# EAGLE design Umbilical (EAGLE 9.5.0)
DESIGNER: Jayson Lopez; PART_NUMBER: 68-0009; PROJECT: CougSat Umbilical; REV: 1.0.4

## Sheet 1 of 4
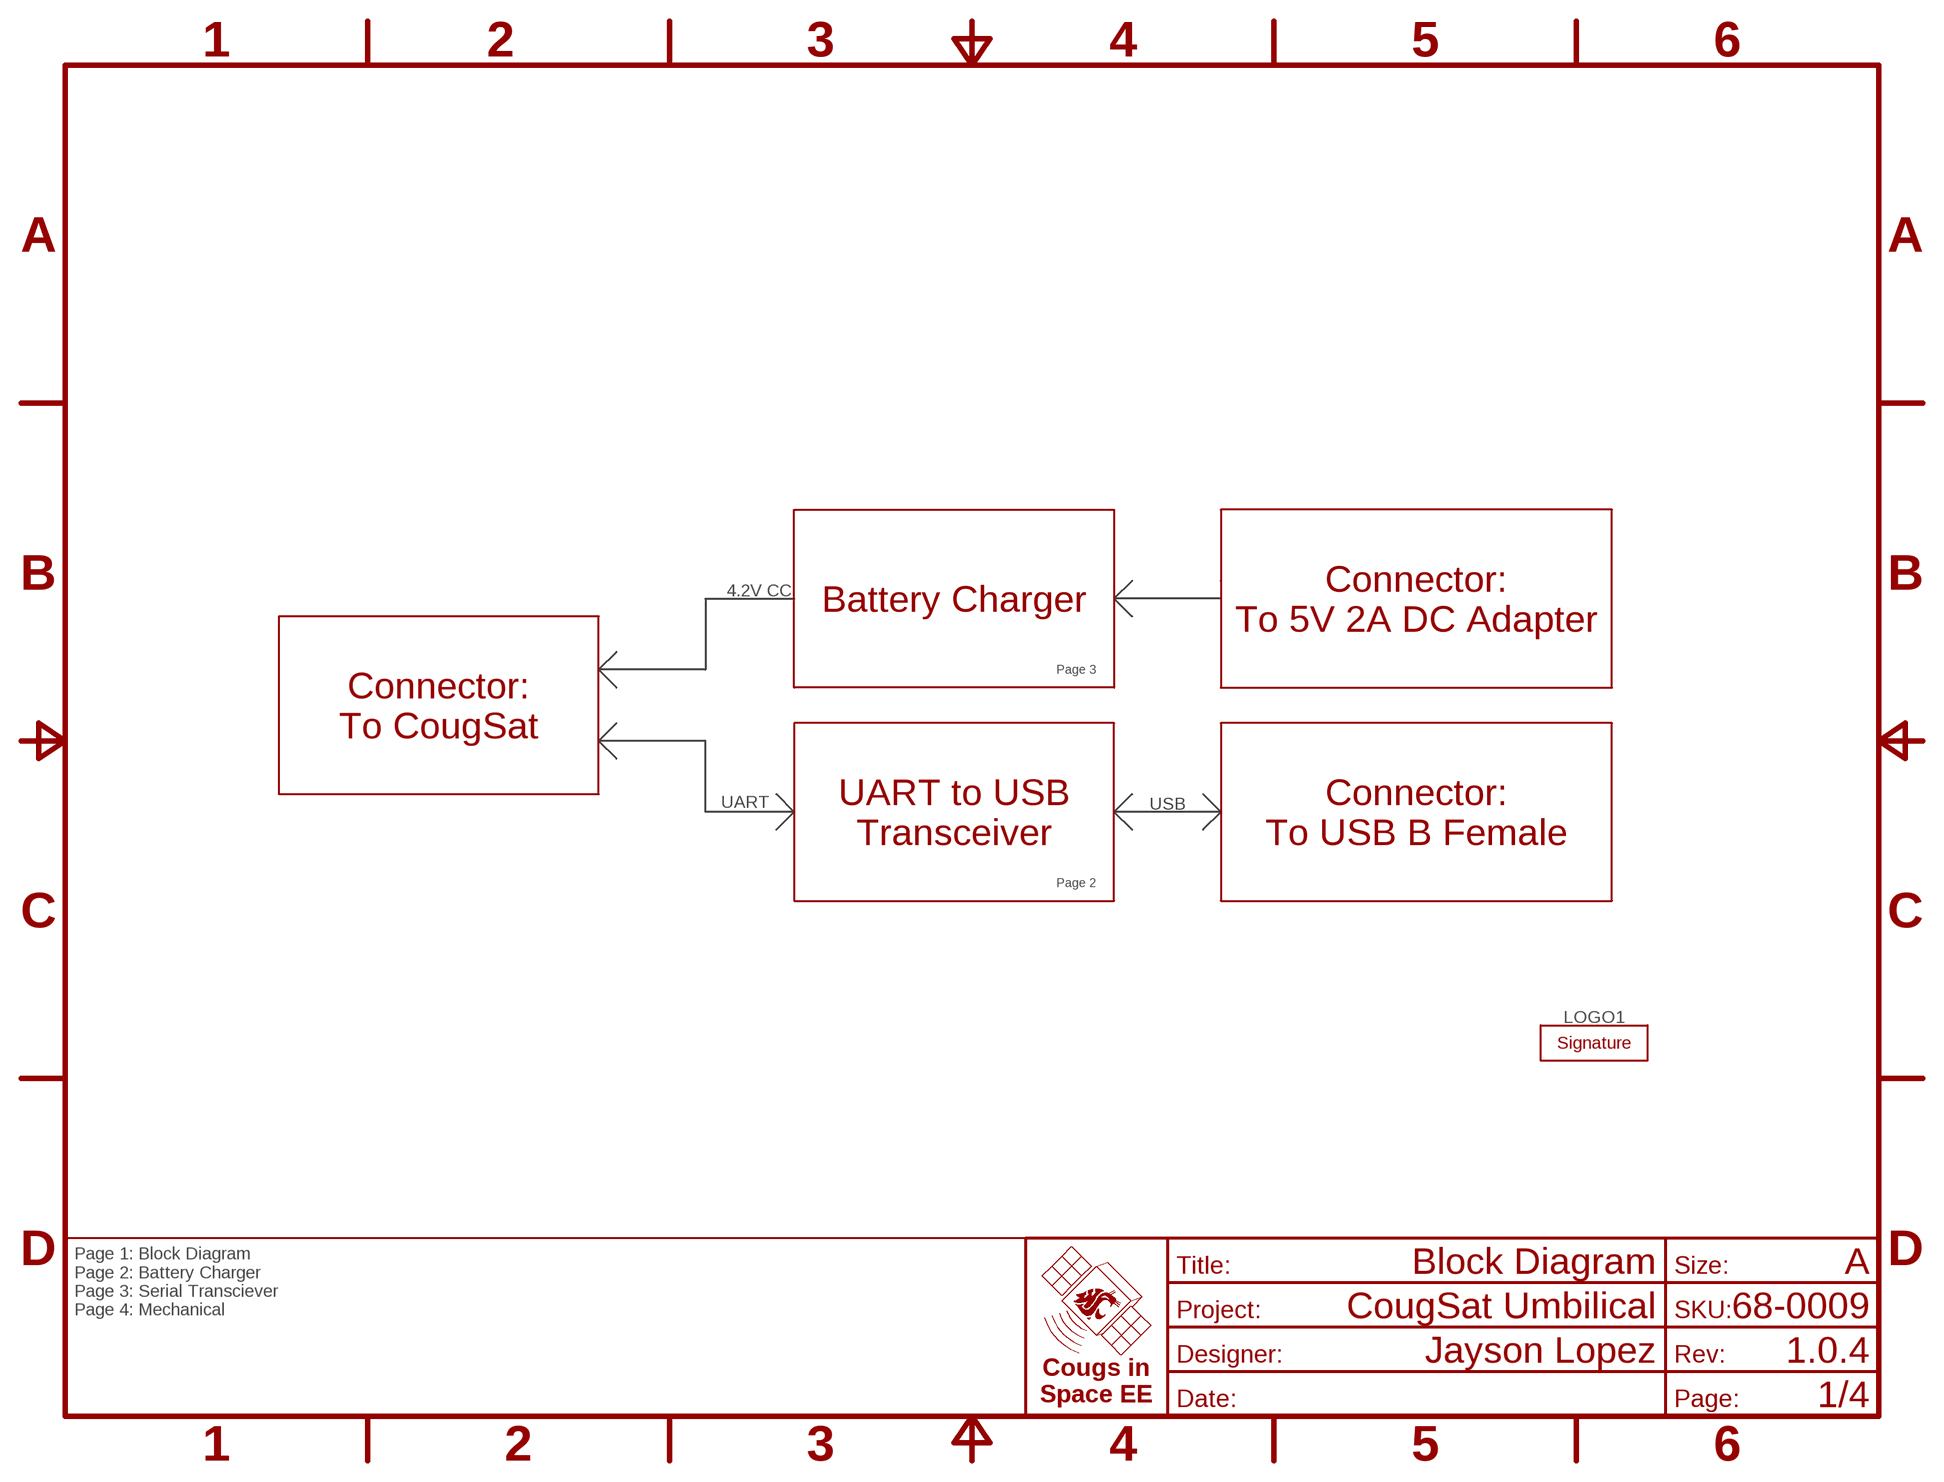
[diagram p0: schematic, sheet 1]
FRAME1 (FRAME-A): REV: 1.0.4; TITLE: Block Diagram

### Parts
LOGO1  SIGNATUREJAYSON  [SIGN-JAYSON]

### Notes on the sheet
- 4.2V CC
- Battery Charger
- Connector:
  To 5V 2A DC Adapter
- Page 3
- Connector:
  To CougSat
- UART | USB
- UART to USB
  Transceiver
- Connector:
  To USB B Female
- Page 2
- Page 1: Block Diagram
  Page 2: Battery Charger
  Page 3: Serial Transciever
  Page 4: Mechanical

## Sheet 2 of 4
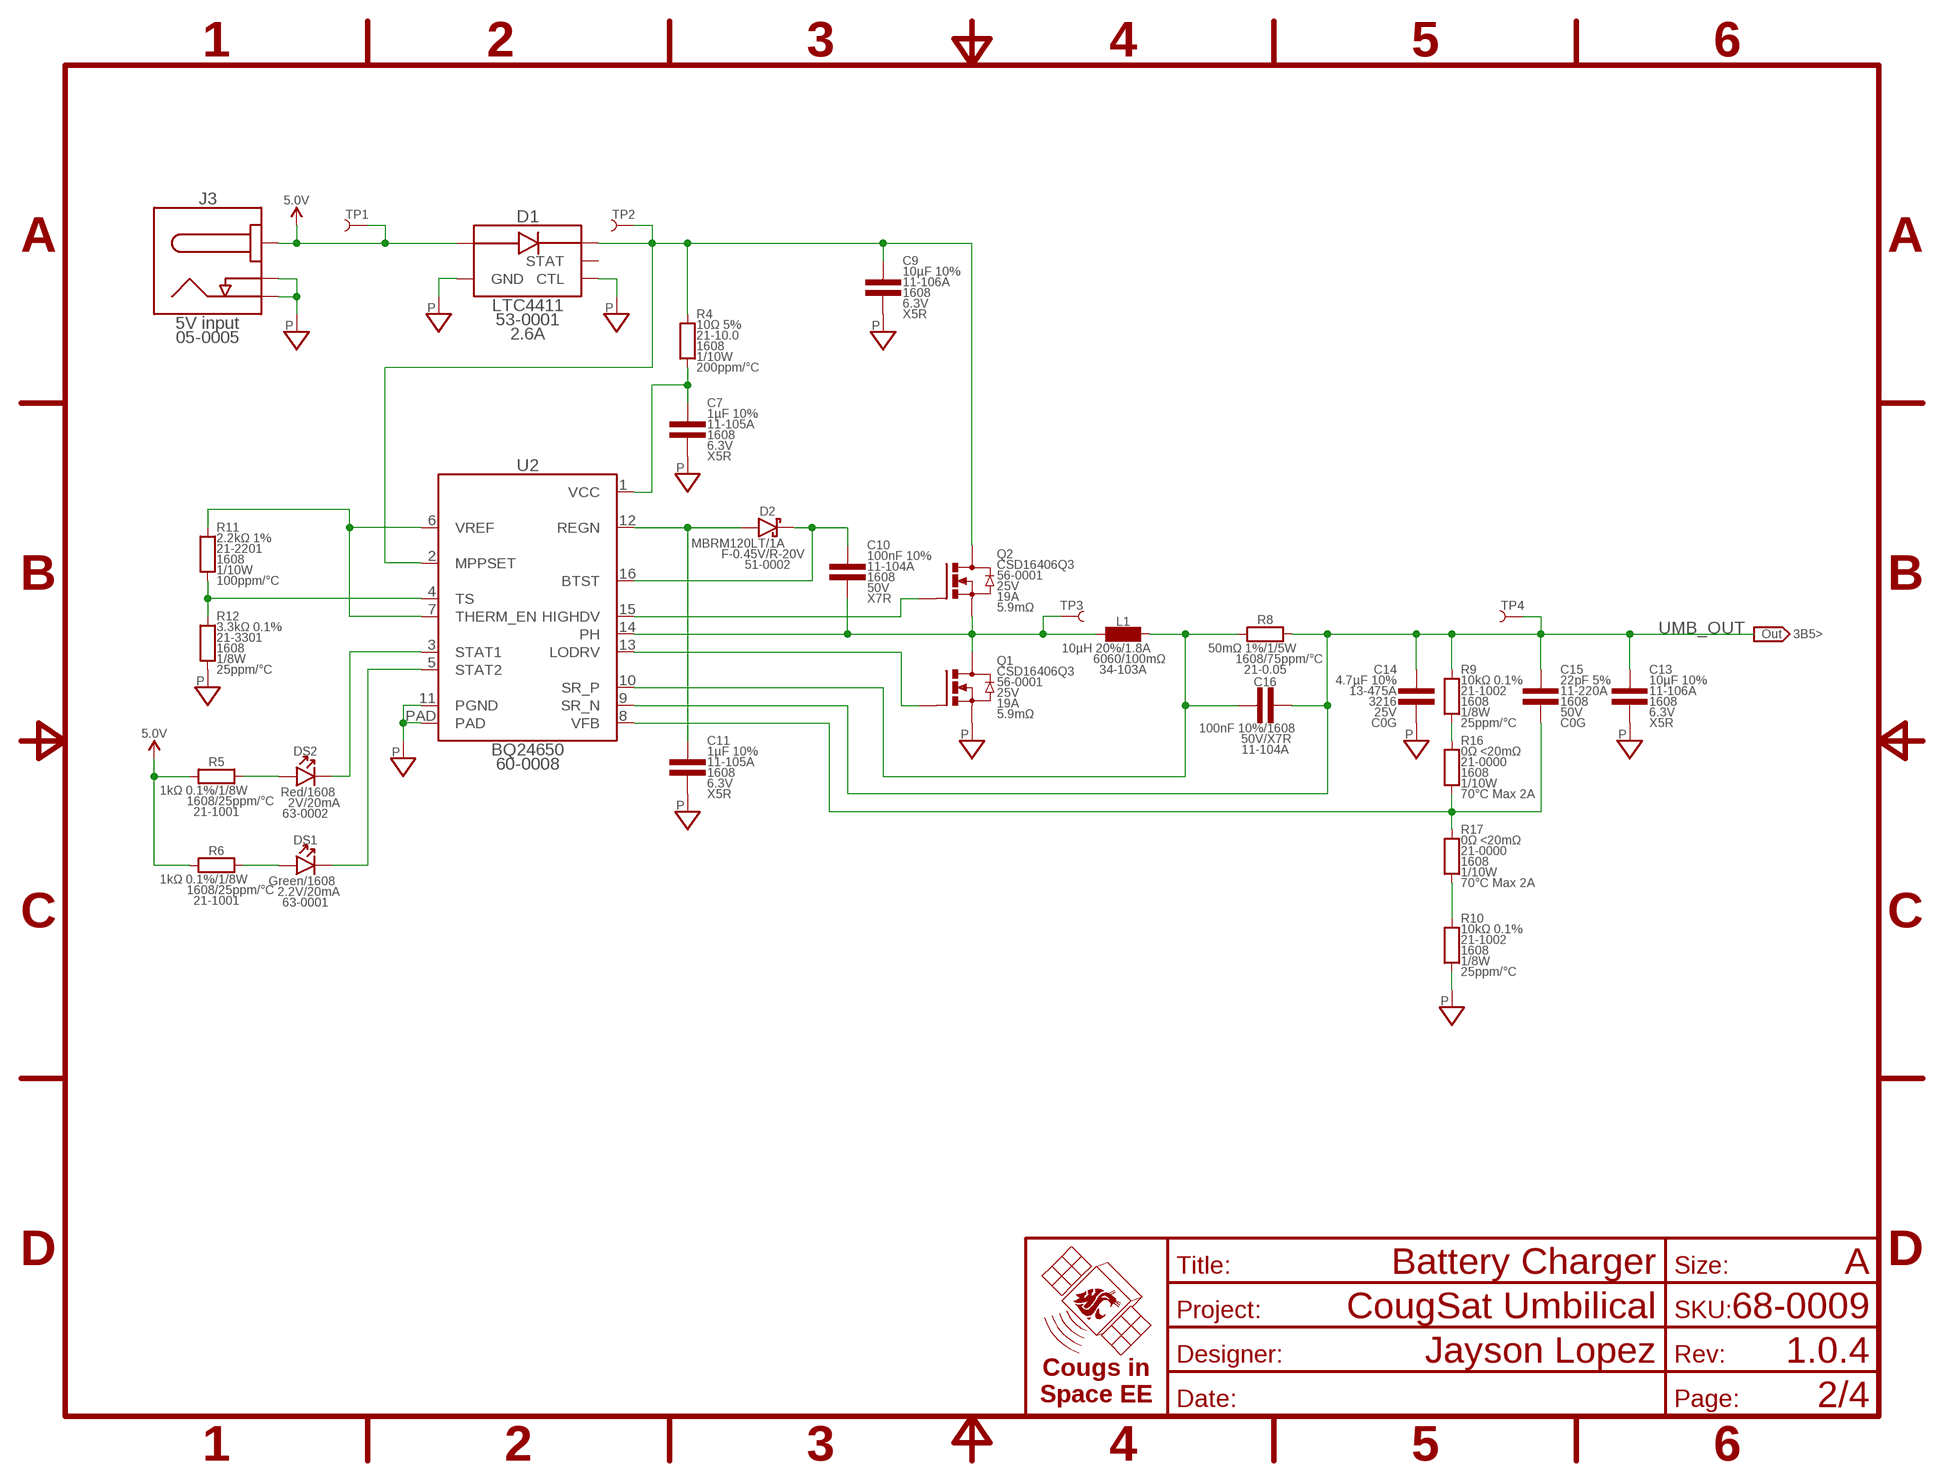
[diagram p1: schematic, sheet 2]
FRAME3 (FRAME-A): REV: 1.0.4; TITLE: Battery Charger

### Parts
C7  1µF 10%  CAP-V-1UF-1608  [1608]
C9  10µF 10%  CAP-V-10UF-1608  [1608]
C10  100nF 10%  CAP-V-100NF-1608  [1608]
C11  1µF 10%  CAP-V-1UF-1608  [1608]
C13  10µF 10%  CAP-V-10UF-1608  [1608]
C14  4.7µF 10%  CAP-V-4.7UF-3216  [3216]
C15  22pF 5%  CAP-V-22PF-1608  [1608]
C16  100nF 10%  CAP-H-100NF-1608  [1608]
D1  LTC4411  [SOT23-5]
D2  MBRM120LT  DIODE-SCHOTTKY-H-POWERMITE  [POWERMITE]
DS1  Green  LED-H-GRN-1608  [1608-POL]
DS2  Red  LED-H-RED-1608  [1608-POL]
J3  5V input  BARREL-2.1X5.5-R  [BARREL-2.1X5.5-R]
L1  10µH 20%  INDUCTOR-H-10UH-6060  [6060]
Q1  CSD16406Q3  MOSFET-N-SON-3333  [SON-3333]
Q2  CSD16406Q3  MOSFET-N-SON-3333  [SON-3333]
R4  10Ω 5%  RES-V-10R-1608  [1608]
R5  1kΩ 0.1%  RES-H-1K-1608  [1608]
R6  1kΩ 0.1%  RES-H-1K-1608  [1608]
R8  50mΩ 1%  RES-H-0.05R-1608  [1608]
R9  10kΩ 0.1%  RES-V-10K-1608  [1608]
R10  10kΩ 0.1%  RES-V-10K-1608  [1608]
R11  2.2kΩ 1%  RES-V-2.2K-1608  [1608]
R12  3.3kΩ 0.1%  RES-V-3.3K-1608  [1608]
R16  0Ω <20mΩ  RES-V-0-1608  [1608]
R17  0Ω <20mΩ  RES-V-0-1608  [1608]
TP1  TEST_POINT-THT-1.0  [THT-1.0]
TP2  TEST_POINT-THT-1.0  [THT-1.0]
TP3  TEST_POINT-THT-1.0  [THT-1.0]
TP4  TEST_POINT-THT-1.0  [THT-1.0]
U2  BQ24650  [QFN-16-3535]

### Nets
5.0V: D1.1(IN) J3.1(CENTER) R5.1 R6.1 TP1.1
BTST: C10.1 D2.C U2.16(BTST)
CHARGING_STAT_G: DS1.C U2.5(STAT2)
CHARGING_STAT_G_LED: DS1.A R6.2
CHARGING_STAT_R: DS2.C U2.3(STAT1)
CHARGING_STAT_R_LED: DS2.A R5.2
DIODE_OUT: C9.1 D1.5(OUT) Q2.5(D) Q2.6(D) Q2.7(D) Q2.8(D) Q2.PAD(D) R4.2 TP2.1 U2.2(MPPSET)
FEEDBACK_HIGH: R9.1 R16.2
FEEDBACK_LOW: R10.2 R17.1
HIGHDV: Q2.4(G) U2.15(HIGHDV)
LODRV: Q1.4(G) U2.13(LODRV)
PGND: C7.2 C9.2 C11.2 C13.2 C14.2 D1.2(GND) D1.3(CTL) J3.2(SLEEVE) J3.3(SW) Q1.1(S) Q1.2(S) Q1.3(S) R10.1 R12.1 U2.11(PGND) U2.PAD ; also sheet 3
PH: C10.2 L1.1 Q1.5(D) Q1.6(D) Q1.7(D) Q1.8(D) Q1.PAD(D) Q2.1(S) Q2.2(S) Q2.3(S) TP3.1 U2.14(PH)
REGN: C11.1 D2.A U2.12(REGN)
SR_P: C16.1 L1.2 R8.1 U2.10(SR_P)
TS: R11.1 R12.2 U2.4(TS)
UMB_OUT: C13.1 C14.1 C15.1 C16.2 R8.2 R9.2 TP4.1 U2.9(SR_N) ; also sheet 3
VCC: C7.1 R4.1 U2.1(VCC)
VFB: C15.2 R16.1 R17.2 U2.8(VFB)
VREF: R11.2 U2.6(VREF) U2.7(THERM_EN)
Unconnected: D1.4(STAT)

### Notes on the sheet
- 3B5>

## Sheet 3 of 4
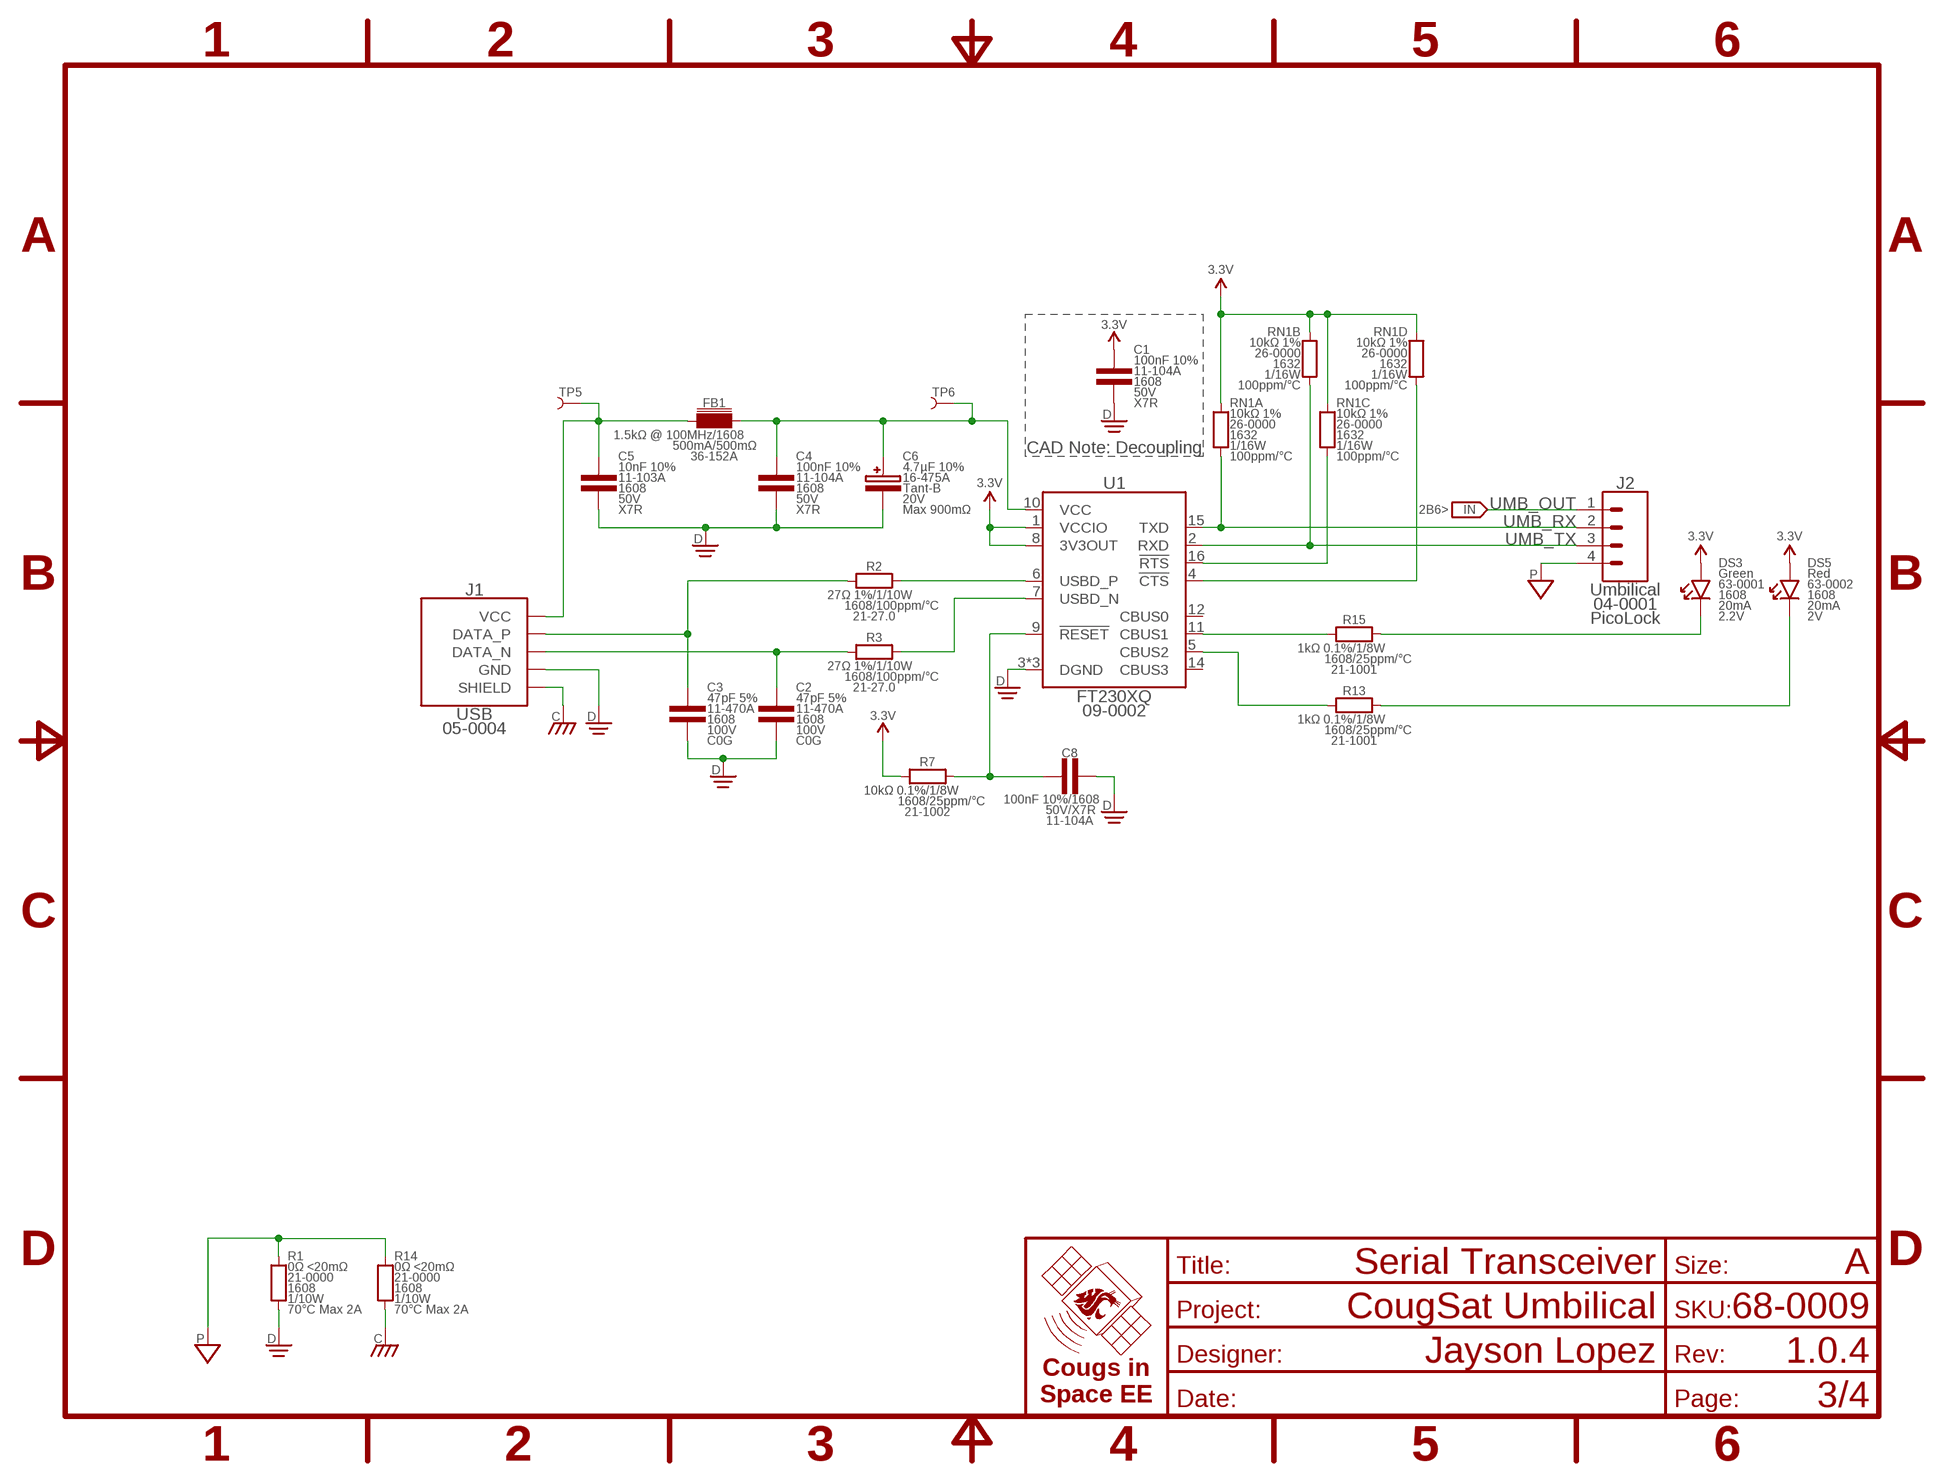
[diagram p2: schematic, sheet 3]
FRAME2 (FRAME-A): TITLE: Serial Transceiver

### Parts
C1  100nF 10%  CAP-V-100NF-1608  [1608]
C2  47pF 5%  CAP-V-47PF-1608  [1608]
C3  47pF 5%  CAP-V-47PF-1608  [1608]
C4  100nF 10%  CAP-V-100NF-1608  [1608]
C5  10nF 10%  CAP-V-10NF-1608  [1608]
C6  4.7µF 10%  CAP-POL-V-4.7UF-4028  [4028-POL]
C8  100nF 10%  CAP-H-100NF-1608  [1608]
DS3  Green  LED-V-GRN-1608  [1608-POL]
DS5  Red  LED-V-RED-1608  [1608-POL]
FB1  1.5kΩ @ 100MHz  CHOKE-H-1.5K-1608  [1608]
J1  USB  USB-B-FEMALE  [USB-B-FEMALE]
J2  Umbilical  1X04-PICOLOCK  [PICOLOCK1.5-04]
R1  0Ω <20mΩ  RES-V-0-1608  [1608]
R2  27Ω 1%  RES-H-27R-1608  [1608]
R3  27Ω 1%  RES-H-27R-1608  [1608]
R7  10kΩ 0.1%  RES-H-10K-1608  [1608]
R13  1kΩ 0.1%  RES-H-1K-1608  [1608]
R14  0Ω <20mΩ  RES-V-0-1608  [1608]
R15  1kΩ 0.1%  RES-H-1K-1608  [1608]
RN1  10kΩ 1%  RES-4-V-10K-1632  [1632]
TP5  TEST_POINT-THT-1.0  [THT-1.0]
TP6  TEST_POINT-THT-1.0  [THT-1.0]
U1  FT230XQ  FT230X-QFN16  [QFN-16-4040]

### Nets
3.3V: C1.1 DS3.A DS5.A R7.1 RN1.5 RN1.6 RN1.7 RN1.8 U1.1(VCCIO) U1.8(3V3OUT)
!CTS: RN1.4 U1.4(!CTS)
!RTS: RN1.3 U1.16(!RTS)
CBUS1: R15.1 U1.11(CBUS1)
CBUS2: R13.1 U1.5(CBUS2)
CHASSIS: J1.SHIELD@1(SHIELD) J1.SHIELD@2(SHIELD) R14.1
DGND: C1.2 C2.2 C3.2 C4.2 C5.2 C6.C C8.2 J1.4(GND) R1.1 U1.3(DGND) U1.13(DGND) U1.PAD(DGND)
PGND: J2.4 R1.2 R14.2 ; also sheet 2
RXLED_C: DS5.C R13.2
TXLED_C: DS3.C R15.2
UMB_OUT: J2.1 ; also sheet 2
UMB_RX: J2.2 RN1.1 U1.15(TXD)
UMB_TX: J2.3 RN1.2 U1.2(RXD)
USB5V: C5.1 FB1.1 J1.1(VCC) TP5.1
USB5V_FILTERED: C4.1 C6.A FB1.2 TP6.1 U1.10(VCC)
USB_CONN_N: C2.1 J1.2(DATA_N) R3.1
USB_CONN_P: C3.1 J1.3(DATA_P) R2.1
USB_N: R3.2 U1.7(USBD_N)
USB_P: R2.2 U1.6(USBD_P)
USB_RESET: C8.1 R7.2 U1.9(!RESET)
Unconnected: U1.12(CBUS0) U1.14(CBUS3)

### Notes on the sheet
- CAD Note: Decoupling
- 2B6>

## Sheet 4 of 4
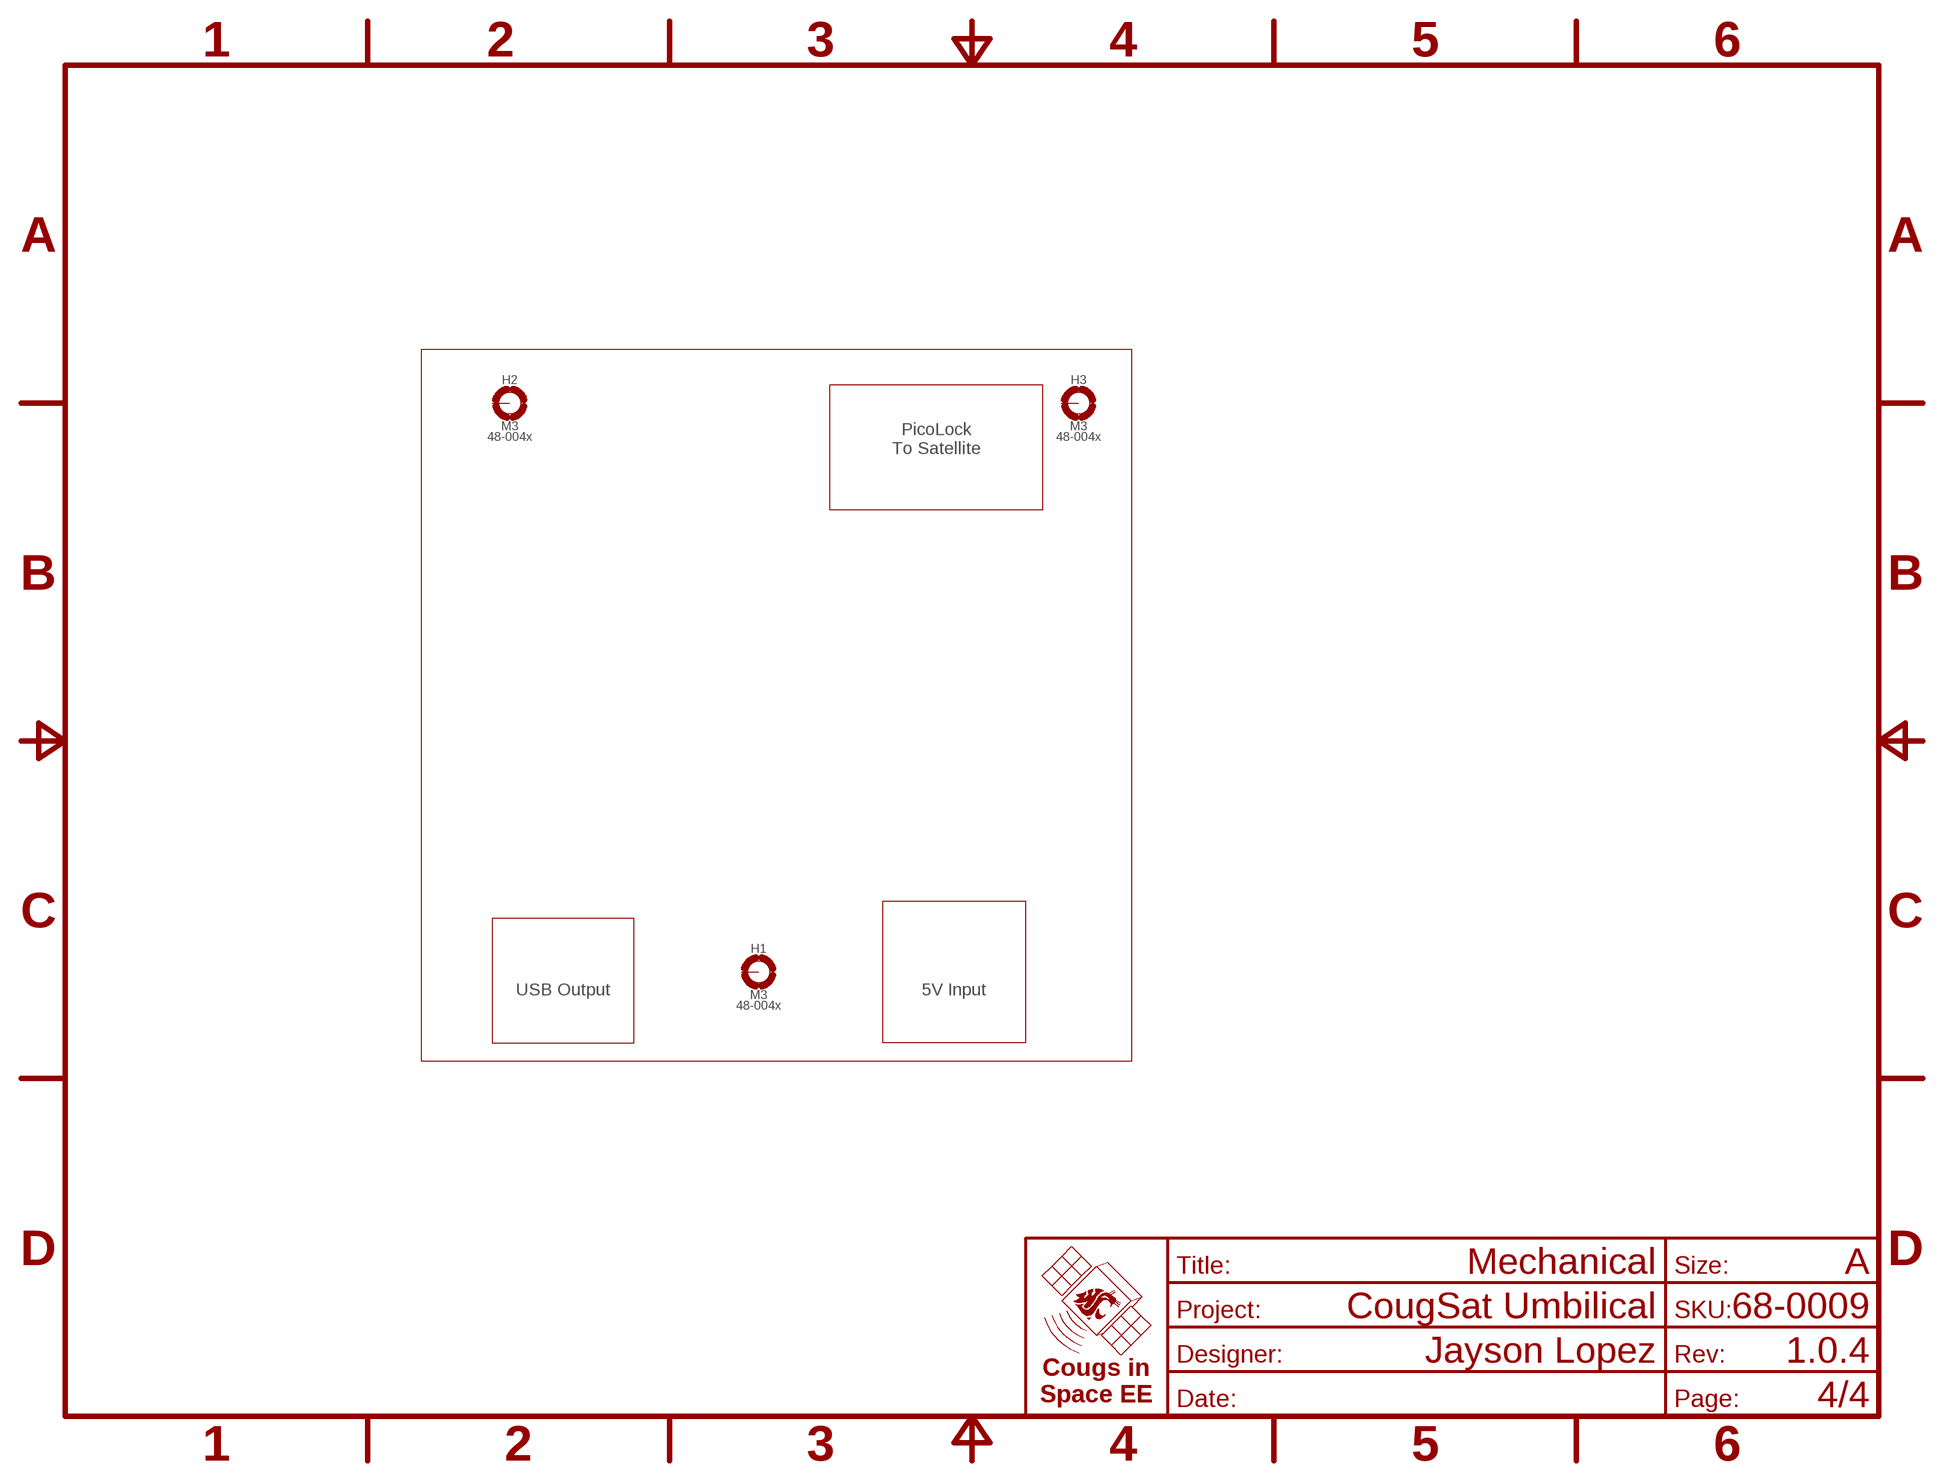
[diagram p3: schematic, sheet 4]
FRAME4 (FRAME-A): TITLE: Mechanical

### Parts
H1  M3  MOUNTING_HOLE-3.3  [MOUNTING_HOLE-3.3]
H2  M3  MOUNTING_HOLE-3.3  [MOUNTING_HOLE-3.3]
H3  M3  MOUNTING_HOLE-3.3  [MOUNTING_HOLE-3.3]
Unconnected: H1.1(MOUNT) H1.V1(MOUNT) H1.V2(MOUNT) H1.V3(MOUNT) H1.V4(MOUNT) H1.V5(MOUNT) H1.V6(MOUNT) H1.V7(MOUNT) H1.V8(MOUNT) H1.V9(MOUNT) H1.V10(MOUNT) H2.1(MOUNT) H2.V1(MOUNT) H2.V2(MOUNT) H2.V3(MOUNT) H2.V4(MOUNT) H2.V5(MOUNT) H2.V6(MOUNT) H2.V7(MOUNT) H2.V8(MOUNT) H2.V9(MOUNT) H2.V10(MOUNT) H3.1(MOUNT) H3.V1(MOUNT) H3.V2(MOUNT) H3.V3(MOUNT) H3.V4(MOUNT) H3.V5(MOUNT) H3.V6(MOUNT) H3.V7(MOUNT) H3.V8(MOUNT) H3.V9(MOUNT) H3.V10(MOUNT)

### Notes on the sheet
- PicoLock
  To Satellite
- USB Output | 5V Input

## Library data of the parts
C1 C4 C10 = CougsInSpace-Capacitors:CAP-V: Capacitor - Vertical Orientation; PACKAGE: 1608; SKU: 11-104A; TEMP: X7R; VOLTAGE: 50V
C2 C3 = CougsInSpace-Capacitors:CAP-V: Capacitor - Vertical Orientation; PACKAGE: 1608; SKU: 11-470A; TEMP: C0G; VOLTAGE: 100V
C5 = CougsInSpace-Capacitors:CAP-V: Capacitor - Vertical Orientation; PACKAGE: 1608; SKU: 11-103A; TEMP: X7R; VOLTAGE: 50V
C6 = CougsInSpace-Capacitors:CAP-POL-V: Capacitor Polarized - Vertical Orientation; ESR: Max 900mΩ; PACKAGE: Tant-B; SKU: 16-475A; VOLTAGE: 20V
C7 C11 = CougsInSpace-Capacitors:CAP-V: Capacitor - Vertical Orientation; PACKAGE: 1608; SKU: 11-105A; TEMP: X5R; VOLTAGE: 6.3V
C8 C16 = CougsInSpace-Capacitors:CAP-H: Capacitor - Horizontal Orientation; PACKAGE: 1608; SKU: 11-104A; TEMP: X7R; VOLTAGE: 50V
C9 C13 = CougsInSpace-Capacitors:CAP-V: Capacitor - Vertical Orientation; PACKAGE: 1608; SKU: 11-106A; TEMP: X5R; VOLTAGE: 6.3V
C14 = CougsInSpace-Capacitors:CAP-V: Capacitor - Vertical Orientation; PACKAGE: 3216; SKU: 13-475A; TEMP: C0G; VOLTAGE: 25V
C15 = CougsInSpace-Capacitors:CAP-V: Capacitor - Vertical Orientation; PACKAGE: 1608; SKU: 11-220A; TEMP: C0G; VOLTAGE: 50V
D1 = CougsInSpace-DiscreteSemi:LTC4411: LTC4411 Ideal diode (transistor acting as a diode); CURRENT: 2.6A; SKU: 53-0001
D2 = CougsInSpace-DiscreteSemi:DIODE-SCHOTTKY-H: Diode Schottky Horizontal; CURRENT: 1A; SKU: 51-0002; VF: F-0.45V; VR: R-20V
DS1 = CougsInSpace-LEDs:LED-H: LED Horizontal; CURRENT: 20mA; PACKAGE: 1608; SKU: 63-0001; VF: 2.2V
DS2 = CougsInSpace-LEDs:LED-H: LED Horizontal; CURRENT: 20mA; PACKAGE: 1608; SKU: 63-0002; VF: 2V
DS3 = CougsInSpace-LEDs:LED-V: LED Vertical; CURRENT: 20mA; PACKAGE: 1608; SKU: 63-0001; VF: 2.2V
DS5 = CougsInSpace-LEDs:LED-V: LED Vertical; CURRENT: 20mA; PACKAGE: 1608; SKU: 63-0002; VF: 2V
FB1 = CougsInSpace-Coils:CHOKE-H: Choke (Ferrite Bead) Horizontal; CURRENT: 500mA; DCR: 500mΩ; PACKAGE: 1608; SKU: 36-152A
H1-H3 = CougsInSpace-Hardware:MOUNTING_HOLE: Mounting Hole; SKU: 48-004x
J1 = CougsInSpace-Connectors:USB: USB 1.0/2.0; SKU: 05-0004
J2 = CougsInSpace-Connectors:1X04: Generic Connector - 4 Conductor; PACKAGE: PicoLock; SKU: 04-0001
J3 = CougsInSpace-Connectors:BARREL: Barrel Connector Normal closed switch; SKU: 05-0005
L1 = CougsInSpace-Coils:INDUCTOR-H: Inductor Horizontal; CURRENT: 1.8A; DCR: 100mΩ; PACKAGE: 6060; SKU: 34-103A
LOGO1 = CougsInSpace-Aesthetics:SIGNATURE: Designer's (Artist's) Signature
Q1 Q2 = CougsInSpace-DiscreteSemi:MOSFET-N: N-Channel MOSFET; CURRENT: 19A; RDS: 5.9mΩ; SKU: 56-0001; VDS: 25V
R1 R14 R16 R17 = CougsInSpace-Resistors:RES-V: Resistor Vertical; PACKAGE: 1608; POWER: 1/10W; SKU: 21-0000; TEMP: 70°C Max 2A
R2 R3 = CougsInSpace-Resistors:RES-H: Resistor Horizontal; PACKAGE: 1608; POWER: 1/10W; SKU: 21-27.0; TEMP: 100ppm/°C
R4 = CougsInSpace-Resistors:RES-V: Resistor Vertical; PACKAGE: 1608; POWER: 1/10W; SKU: 21-10.0; TEMP: 200ppm/°C
R5 R6 R13 R15 = CougsInSpace-Resistors:RES-H: Resistor Horizontal; PACKAGE: 1608; POWER: 1/8W; SKU: 21-1001; TEMP: 25ppm/°C
R7 = CougsInSpace-Resistors:RES-H: Resistor Horizontal; PACKAGE: 1608; POWER: 1/8W; SKU: 21-1002; TEMP: 25ppm/°C
R8 = CougsInSpace-Resistors:RES-H: Resistor Horizontal; PACKAGE: 1608; POWER: 1/5W; SKU: 21-0.05; TEMP: 75ppm/°C
R9 R10 = CougsInSpace-Resistors:RES-V: Resistor Vertical; PACKAGE: 1608; POWER: 1/8W; SKU: 21-1002; TEMP: 25ppm/°C
R11 = CougsInSpace-Resistors:RES-V: Resistor Vertical; PACKAGE: 1608; POWER: 1/10W; SKU: 21-2201; TEMP: 100ppm/°C
R12 = CougsInSpace-Resistors:RES-V: Resistor Vertical; PACKAGE: 1608; POWER: 1/8W; SKU: 21-3301; TEMP: 25ppm/°C
RN1 = CougsInSpace-Resistors:RES-4-V: Resistor Array - 4 - Vertical; PACKAGE: 1632; POWER: 1/16W; SKU: 26-0000; TEMP: 100ppm/°C
TP1-TP6 = CougsInSpace-Connectors:TEST_POINT: Test Point Used to probe points in a circuit for debugging or general measurement
U1 = CougsInSpace-IC-Comms:FT230X: FT230x USB/UART Bridge FT230x <https://github.com/CougsInSpace/Resources/blob/master/SupplierDocuments/FTDI/FT230X_USB-UARTBridge.pdf>; SKU: 09-0002
U2 = CougsInSpace-IC-Power:BQ24650: BQ24650 Solar Battery Charger BQ24650 <https://github.com/CougsInSpace/Resources/blob/master/SupplierDocuments/Ti/SolarBatteryCharger_BQ24650.pdf>; SKU: 60-0008

## Board
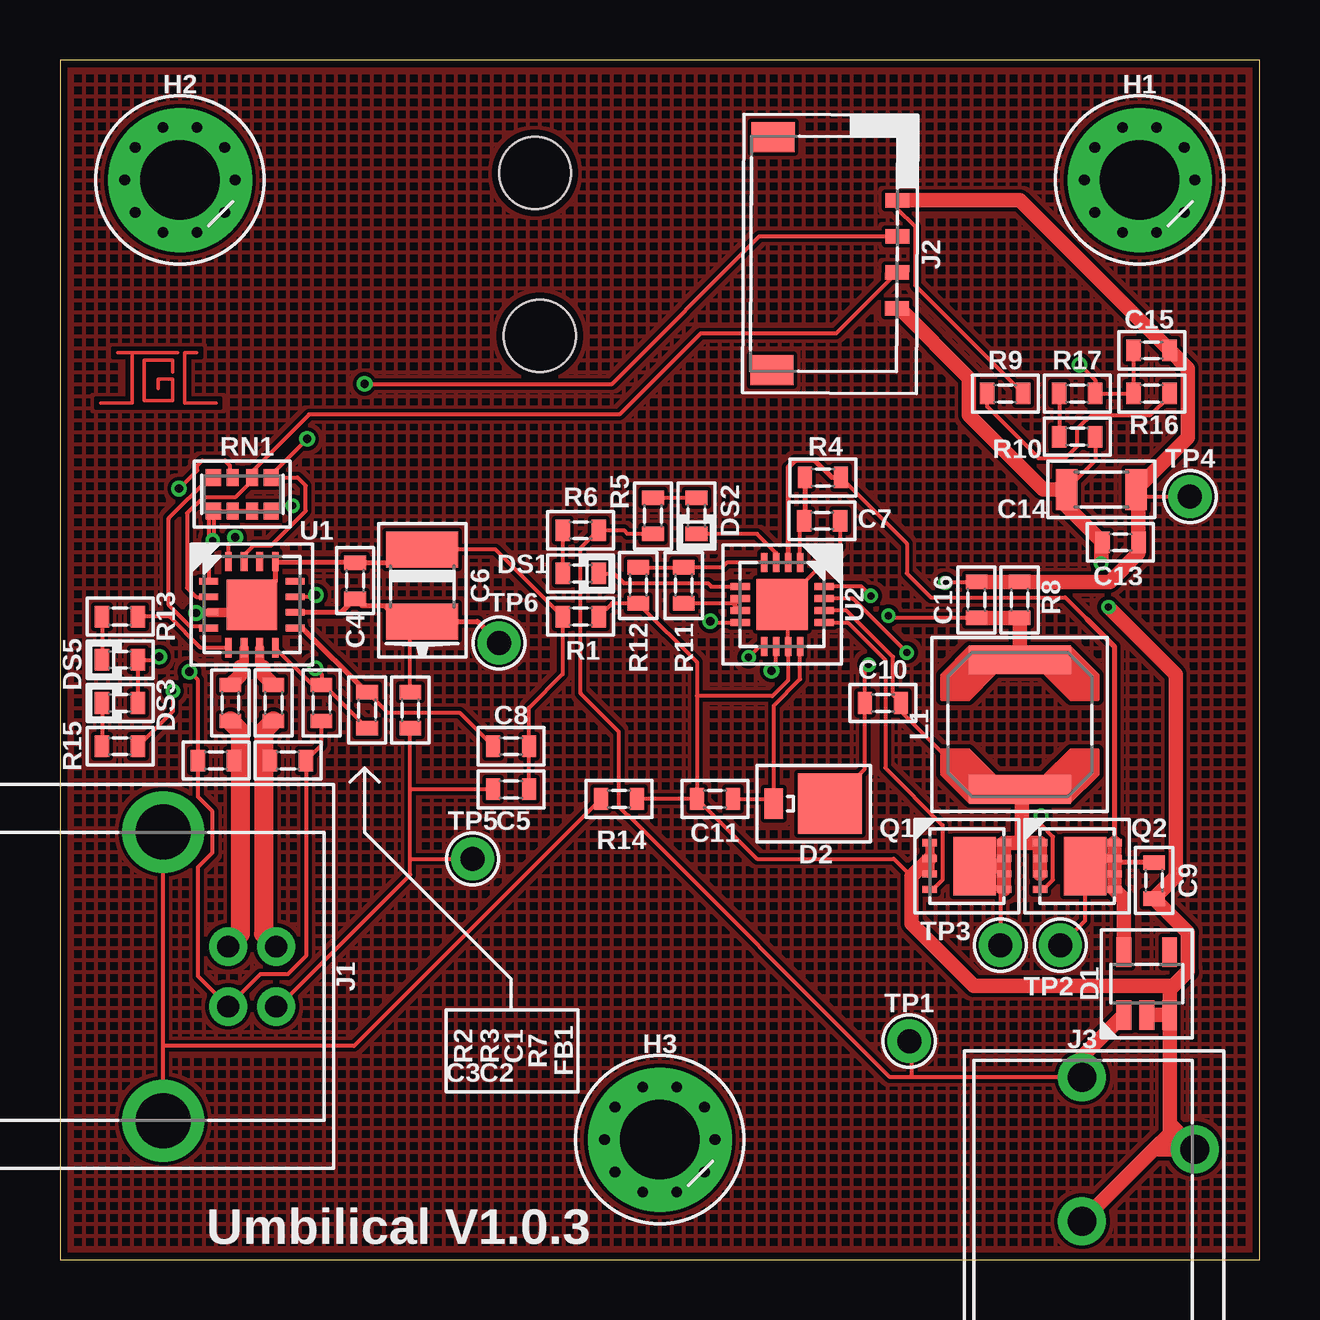
[diagram p4: board, top side]
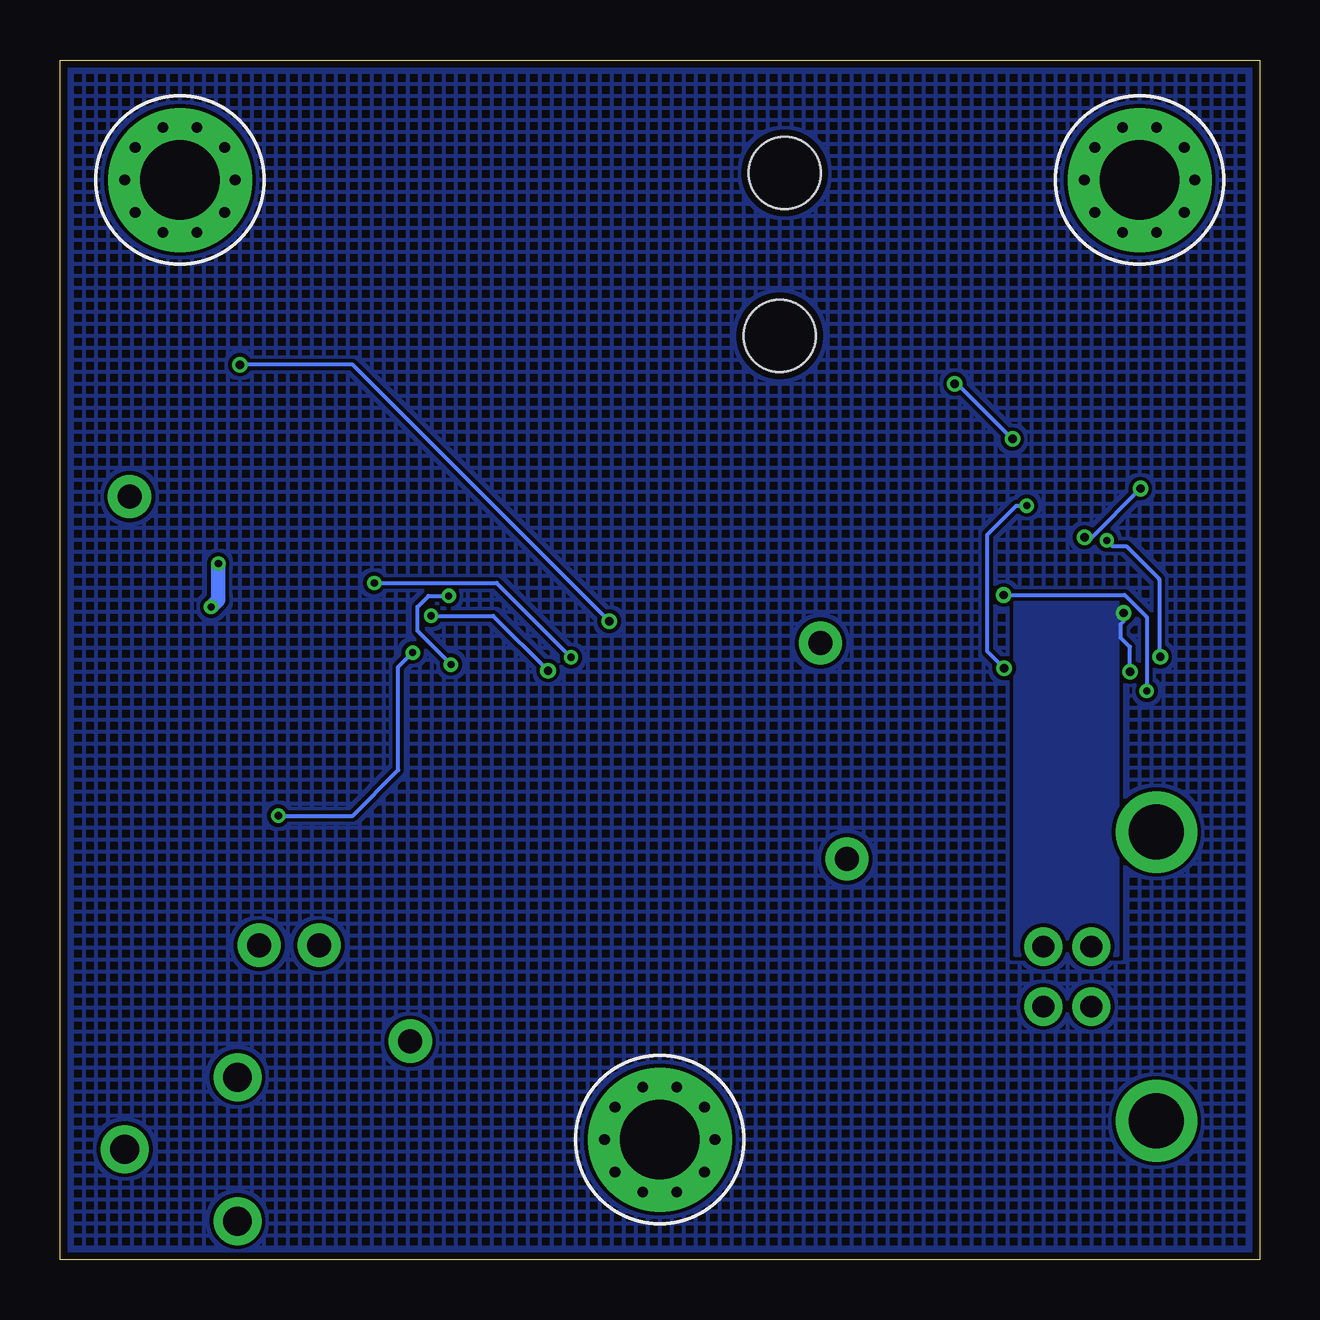
[diagram p5: board, bottom side, seen from below]

Size 50 x 50 mm. Coordinates in mm from the lower left corner, seen from the top.
Outline: 0,0 50,0 50,50 0,50 0,0
Copper layers (1*16): Top 0.035mm / dielectric 1.6mm / Bottom 0.035mm
Design rules "CougsInSpace": minimum track width 0.16mm, minimum drill 0.3mm, track to track 0.16mm, track to pad 0.16mm, pad to pad 0.16mm, via to via 0.16mm, smd to smd 0mil, copper to edge 0.3mm, drill to drill 0.3mm, minimum pad ring 0.15mm, minimum via ring 0.15mm, stop-mask expansion 0mil, vias tented up to drill 1mm, thermal gap 0.25mm
Holes 3 mm at 19.8,45.3 20,38.5

### Footprints (pad centres in the part's own frame; a part is rotated, then mirrored left to right if it is on the bottom)
1608 = smd 0.6 x 0.9: 1 -0.75,0; 2 0.75,0
4028-POL = smd 1.5 x 3: A 1.5,0; C -1.5,0
3216 = smd 0.9 x 1.7: 1 -1.45,0; 2 1.45,0
SOT23-5 = smd 1.22 x 0.62: 1 -1.31,0.95; 2 -1.31,0; 3 -1.31,-0.95; 4 1.31,-0.95; 5 1.31,0.95
POWERMITE = smd 0.76 x 1.27: A 2.349,0 | smd 2.67 x 2.54: C 0,0
1608-POL = smd 0.6 x 0.9: A 0.75,0; C -0.75,0
MOUNTING_HOLE-3.3 = drill 3.3 pad 6: 1 0,0 | drill 0.45 pad 0.6: V1 2.3,0; V2 1.861,1.352; V3 0.711,2.187; V4 -0.711,2.187; V5 -1.861,1.352; V6 -2.3,0; V7 -1.861,-1.352; V8 -0.711,-2.187; V9 0.711,-2.187; V10 1.861,-1.352
USB-B-FEMALE = drill 0.9 pad 1.6: 1 1.25,4.71; 2 -1.25,4.71; 3 -1.25,2.71; 4 1.25,2.71 | drill 2.3 pad 3.4: SHIELD@1 -6.02,0; SHIELD@2 6.02,0
PICOLOCK1.5-04 = smd 0.6 x 1: 1 2.25,0; 2 0.75,0; 3 -0.75,0; 4 -2.25,0 | smd 1.25 x 1.8: PAD@1 4.855,5.2; PAD@2 -4.855,5.2
BARREL-2.1X5.5-R = drill 1.2 pad 2: 1 0,-3; 2 0,3; 3 -4.7,0
6060 = smd 1.2 x 4.25: 1 -2.7,0; 2 2.7,0
SON-3333 = smd 0.6 x 0.3: 1 -1.55,0.975; 2 -1.55,0.325; 3 -1.55,-0.325; 4 -1.55,-0.975; 5 1.55,-0.975; 6 1.55,-0.325; 7 1.55,0.325; 8 1.55,0.975 | smd 1.775 x 2.45: PAD 0.325,0
1632 = smd 0.64 x 0.7: 1 -1.2,-0.7; 4 1.2,-0.7; 5 1.2,0.7; 8 -1.2,0.7 | smd 0.5 x 0.7: 2 -0.4,-0.7; 3 0.4,-0.7; 6 0.4,0.7; 7 -0.4,0.7
THT-1.0 = drill 1 pad 1.8: 1 0,0
QFN-16-4040 = smd 0.8 x 0.28: 1 -1.8,0.975; 2 -1.8,0.325; 3 -1.8,-0.325; 4 -1.8,-0.975; 9 1.8,-0.975; 10 1.8,-0.325; 11 1.8,0.325; 12 1.8,0.975 | smd 0.28 x 0.8: 5 -0.975,-1.8; 6 -0.325,-1.8; 7 0.325,-1.8; 8 0.975,-1.8; 13 0.975,1.8; 14 0.325,1.8; 15 -0.325,1.8; 16 -0.975,1.8 | smd 2.1 x 2.1: PAD 0,0
QFN-16-3535 = smd 0.8 x 0.28: 1 -1.75,0.75; 2 -1.75,0.25; 3 -1.75,-0.25; 4 -1.75,-0.75; 9 1.75,-0.75; 10 1.75,-0.25; 11 1.75,0.25; 12 1.75,0.75 | smd 0.28 x 0.8: 5 -0.75,-1.75; 6 -0.25,-1.75; 7 0.25,-1.75; 8 0.75,-1.75; 13 0.75,1.75; 14 0.25,1.75; 15 -0.25,1.75; 16 -0.75,1.75 | smd 2.14 x 2.14: PAD 0,0

### Placement (x,y rotation side)
C1  10.9,23.2 270 top
C2  9.5,20.8 0 top
C3  6.5,20.8 180 top
C4  12.3,28.3 90 top
C5  18.8,19.6 0 top
C6  15.1,28.1 270 top
C7  31.77,30.79 0 top
C8  18.8,21.4 0 top
C9  45.6,15.8 270 top
C10  34.3,23.2 0 top
C11  27.3,19.2 180 top
C13  44.2,29.9 180 top
C14  43.4,32.1 180 top
C15  45.5,37.9 180 top
C16  38.2,27.5 90 top
D1  45.3,11.5 90 top
D2  32.1,19 180 top
DS1  21.7,28.6 180 top
DS2  26.53,31 90 top
DS3  2.5,23.2 0 top
DS5  2.5,25 0 top
FB1  14.6,22.9 90 top
H1  45,45 0 top
H2  5,45 0 top
H3  25,5 0 top
J1  4.3,11.8 270 top
J2  34.9,41.9 89.7 top
J3  42.6,4.6 180 top
L1  40,22.3 90 top
LOGO1  4.1,36.7 0 top
Q1  37.8,16.4 0 top
Q2  42.4,16.4 0 top
R1  21.7,26.8 0 top
R2  7.1,23.2 90 top
R3  8.9,23.2 90 top
R4  31.8,32.6 0 top
R5  24.72,31 90 top
R6  21.7,30.4 180 top
R7  12.8,22.9 90 top
R8  40,27.5 90 top
R9  39.4,36.1 0 top
R10  42.4,34.3 180 top
R11  26,28.1 270 top
R12  24.1,28.1 90 top
R13  2.5,26.8 180 top
R14  23.3,19.2 0 top
R15  2.5,21.4 180 top
R16  45.5,36.1 0 top
R17  42.4,36.1 0 top
RN1  7.6,31.9 180 top
TP1  35.4,9.1 0 top
TP2  41.7,13.1 0 top
TP3  39.2,13.1 0 top
TP4  47.1,31.8 0 top
TP5  17.2,16.7 0 top
TP6  18.3,25.7 0 top
U1  8,27.3 0 top
U2  30.1,27.3 270 top

### Tracks (layer width: path | path; a pad name or v marks a point on that pad's centre or on a via)
3.3V  (via drill 0.3, 0.35)
  Top 0.16: U1.8 10.53,23.95 C1.1 10.9,24.4 v10.65,24.65 | RN1.5 6.2,31 U1.1 | R7.1 11,23.95 | RN1.5 RN1.6 RN1.7 RN1.8 9.03,31.43 v9.7,31.43 | DS3.A DS5.A 4.01,25 v4.13,25.12 | v6.37,29.97 6.4,30.01 RN1.5
  Top 0.4: 11,23.95 C1.1
  Bottom 0.16: v10.65,24.65 11.35,25.35 11.35,30.22 10.14,31.43 v9.7,31.43 | v6.37,29.97 6.13,29.73 5.56,29.73 4.18,28.36 4.18,25.16 v4.13,25.12
5.0V
  Top 0.16: R5.1 23.65,30.25 23.5,30.4 R6.1 21.7,29.65 21.7,23.6 23.3,22 23.3,18.86 23.65,18.51 23.69,18.51 34.6,7.6 35.4,7.6 | TP1.1 35.5,9 35.5,7.7 35.4,7.6 | J3.1 35.4,7.6
  Top 0.6: J3.1 42.6,8.44 D1.1
!CTS
  Top 0.16: U1.4 6.14,26.39 5.43,26.39 4.54,27.29 4.54,30.91 6.23,32.6 RN1.4
!RTS  (via drill 0.35)
  Top 0.16: v4.97,32.13 5.72,32.89 5.72,33.1 5.93,33.31 6.87,33.31 7.08,33.1 7.08,32.72 RN1.3 | U1.16 7.03,29.82 v7.3,30.1
  Bottom 0.16: v7.3,30.1 7,30.1 v4.97,32.13
BALANCING-BOTTOM
  pour Bottom (rank 6, hatched): 0,0 0,50 50,50 50,0
BALANCING-TOP
  pour Top (rank 6, hatched): 0,0.1 0,50 50,50 50,0.1
BTST  (via drill 0.3)
  Top 0.16: v33.8,27.66 33.41,28.05 U2.16 | D2.C 33.55,20.45 C10.1 33.55,24.65 v33.7,24.8
  Bottom 0.16: v33.7,24.8 35.1,26.2 35.1,27.2 34.64,27.66 v33.8,27.66
CBUS1  (via drill 0.3, 0.35)
  Top 0.16: v10.66,27.7 10.59,27.62 U1.11 | v4.7,23.7 4.7,22.85 R15.1
  Bottom 0.16: v10.66,27.7 5.62,27.7 4.7,26.78 v4.7,23.7
CBUS2
  Top 0.16: U1.5 5.87,25.5 4.57,26.8 R13.1
CHARGING_STAT_G
  Top 0.16: DS1.C 23.09,28.6 23.5,28.19 27.01,28.19 27.15,28.05 U2.5
CHARGING_STAT_G_LED
  Top 0.16: R6.2 DS1.A
CHARGING_STAT_R
  Top 0.16: U2.3 29.85,29.46 29.06,30.25 DS2.C
CHARGING_STAT_R_LED
  Top 0.16: DS2.A R5.2
CHASSIS
  Top 0.16: J1.SHIELD@2 4.3,8.9 | 4.3,8.9 J1.SHIELD@1 | R14.1 12.25,8.9 4.3,8.9
DGND  (via drill 0.35)
  Top 0.16: C1.2 10.9,21.45 C2.2 10.25,12.65 9.49,11.89 8.35,11.89 J1.4 5.75,11.81 5.75,16.36 6.36,16.97 6.36,18.67 5.75,19.28 C3.2 5.75,24.15 v5.4,24.5 | v5.67,26.95 5.69,26.98 6.6,26.98 | C6.C 18.15,29.6 R1.1 20.95,24.4 19.55,23 C8.2 C5.2
  Top 0.2: C6.C 14.55,29.05 C4.2 9.03,29.05 U1.13 8.97,28.27 U1.PAD 7.67,26.98 6.6,26.98 U1.3
  Top 0.4: U1.3 7.67,26.98
  Bottom 0.16: v5.4,24.5 5.4,25.53 5.79,25.92 5.79,26.48 5.67,26.6 v5.67,26.95
  pour Bottom: 5.9,12.7 5.9,27.4 10.2,27.4 10.2,12.7
DIODE_OUT
  Top 0.16: R4.2 35.3,29.85 35.3,28.6 36.3,27.6 41.9,27.6 42.8,26.7 | Q2.PAD 42.73,14.12 TP2.1
  Top 0.2: R4.2 32.17,32.6 31.46,33.31 30.64,33.31 30.35,33.02 U2.2 | 42.8,26.7 43.95,25.55 Q2.8 | 44.12,16.55 Q2.7 43.95,16.38 | C9.1 44.12,16.55 | 43.95,16.1 43.95,16.38 | 44.12,16.55 43.95,16.38 | Q2.6 Q2.5
  Top 0.4: Q2.PAD 43.05,16.73 Q2.7
  Top 0.6: D1.5 44.35,15.03 Q2.5 43.95,16.1 | Q2.6 Q2.7 Q2.8
FEEDBACK_HIGH
  Top 0.16: 46.25,36 45.45,35.2 43,35.2 42.79,34.99 42.75,34.99 42.4,34.64 42.4,33.9 41.9,33.4 40.8,33.4 38.65,35.55 R9.1
  Top 0.2: 46.25,36 R16.2
FEEDBACK_LOW
  Top 0.16: R17.1 R10.2
HIGHDV  (via drill 0.3)
  Top 0.16: U2.15 33.05,27.55 v35.3,25.3 | Q2.4 40.96,15.54 41.1,15.54 41.39,15.83 41.39,17.62 40.9,18.11 v40.9,18.5
  Bottom 0.16: v35.3,25.3 35.9,24.7 35.9,20.4 37.8,18.5 v40.9,18.5
LODRV
  Top 0.16: U2.13 32.83,26.55 34.4,24.98 34.4,20.49 36.79,18.1 36.79,15.83 36.39,15.43 Q1.4
PGND  (via drill 0.3)
  Top 0.16: 26.55,23.5 26.55,24.9 R12.1 23,27.35 R1.2 | 26.55,23.5 C11.2 | C11.2 29.05,16.7 34.76,16.7 35.49,15.96 | 26.55,23.5 26.57,23.48 29.69,23.48 30.35,24.14 U2.11 30.35,27.05 U2.PAD 32.52,29.72 C7.2 | C11.2 R14.2 | R10.1 43.15,33.3 C14.2
  Top 0.4: Q1.1 Q1.2 Q1.3
  Top 0.6: J3.2 45.6,4.6 | 45.6,4.6 J3.3 46.25,5.65 | 46.25,5.65 D1.3 | D1.3 D1.2 | 45.6,4.6 46.25,5.25 46.25,5.65 | D1.3 46.25,11.24 | v43.7,27.2 46.51,24.39 46.51,15.96 C9.2 47.02,13.63 47.02,12.01 46.41,11.4 | v43.4,29.01 43.4,29.85 C13.2 41.95,31.4 C14.2 40.99,32.1 37.89,35.2 37.89,36.74 34.98,39.65 J2.4 | Q1.2 35.49,15.96 35.49,14.01 38.1,11.4 46.09,11.4 | 46.09,11.4 46.25,11.24 | 46.25,11.24 46.41,11.4 | 46.41,11.4 46.09,11.4
  Bottom 0.6: v43.7,27.2 43.4,27.5 v43.4,29.01
PH
  Top 0.16: L1.1 38.3,19.6 35.05,22.85 C10.2 34.72,23.53 34.72,25.12 32.79,27.05 U2.14 | Q1.PAD 39.2,15.32 TP3.1 | Q2.2 40.85,16.6 | Q1.7 39.35,16.8 | Q1.6 39.35,16
  Top 0.4: L1.1 39.04,19.6
  Top 0.6: Q2.3 40.85,16.6 Q2.1 40.1,17.38 | 39.35,16.4 39.35,16.8 Q1.8 40.1,17.38 | Q1.5 39.35,16 39.35,16.4 | Q1.PAD 39.35,16.4 | 40.1,17.38 40.1,19.5 L1.1
REGN
  Top 0.16: C11.1 29.55,19.2 D2.A 29.75,23.09 30.85,24.19 U2.12
RXLED_C
  Top 0.16: R13.2 DS5.C
SR_P  (via drill 0.3, 0.35)
  Top 0.16: v29.66,24.55 29.85,24.74 U2.10 | C16.1 34.61,26.75 v34.53,26.83
  Top 0.6: L1.2 R8.1 C16.1
  Bottom 0.16: v34.53,26.83 31.94,26.83 v29.66,24.55
TS
  Top 0.16: R12.2 R11.1 27.6,28.85 27.8,29.05 U2.4
TXLED_C
  Top 0.16: DS3.C R15.2
UMB_OUT  (via drill 0.3)
  Top 0.16: v28.7,25.1 29.15,25.55 U2.9 | v36.9,28.2 36.95,28.25 C16.2 | C14.1 44.9,32.1 45.2,31.8 TP4.1 | J2.1 34.91,43.78 35.65,43.05 35.65,40.6 R9.2
  Top 0.6: C16.2 R8.2 43.75,28.25 44.95,29.45 C13.1 44.95,32 C14.1 47.01,34.26 47.01,37.14 C15.1 40,44.15 J2.1
  Bottom 0.16: v36.9,28.2 31.8,28.2 v28.7,25.1
UMB_RX  (via drill 0.35)
  Top 0.16: U1.15 7.67,29.36 8.08,29.76 8.8,29.76 10.24,31.2 10.24,32.26 9.9,32.6 RN1.1 8.8,32.7 v10.3,34.2 | v12.7,36.5 23,36.5 29.15,42.65 J2.2
  Bottom 0.16: v10.3,34.2 12.6,36.5 v12.7,36.5
UMB_TX
  Top 0.16: J2.3 32.35,38.6 26.7,38.6 23.32,35.22 10.38,35.22 8,32.84 RN1.2 8,32.46 7.33,31.79 5.98,31.79 5.3,31.11 5.3,28 5.67,27.62 U1.2
USB5V
  Top 0.16: J1.1 9.11,10.55 14.6,16.04 14.6,16.7 | 14.6,16.7 14.6,19.6 | 14.6,19.6 FB1.1 | C5.1 14.6,19.6 | 14.6,16.7 TP5.1
USB5V_FILTERED
  Top 0.16: 14.65,26.15 15,26.5 C6.A | FB1.2 14.6,26.1
  Top 0.2: 14.6,26.1 14.65,26.15 13.55,27.25 12.6,27.25 C4.1 11.72,26.98 U1.10 | C6.A 17.4,26.6 TP6.1
USB_CONN_N
  Top 0.16: C2.1 8.48,20.8
  Top 0.8: J1.2 8.48,13.58 8.48,20.8 8.48,22.03 R3.1
USB_CONN_P
  Top 0.16: C3.1 7.52,20.8
  Top 0.8: J1.3 7.52,13.56 7.52,20.8 7.52,22.03 R2.1
USB_N
  Top 0.4: 8.46,24.7 8.32,24.84 U1.7
  Top 0.6: R3.2 8.46,24.39 8.46,24.7
USB_P
  Top 0.4: 7.5,24.7 7.67,24.88 U1.6
  Top 0.6: R2.2 7.5,24.35 7.5,24.7
USB_RESET
  Top 0.16: R7.2 13.65,22.8 16.65,22.8 C8.1
  Top 0.2: U1.9 10.1,26.32 12.78,23.65 R7.2
VCC
  Top 0.16: U2.1 30.85,30.62 C7.1
  Top 0.2: R4.1 31.05,30.82 C7.1
VFB  (via drill 0.35)
  Top 0.16: U2.8 27.15,26.55 v27.1,26.6 | v42.5,37.3 43.15,36.65 R17.2 R16.1 C15.2
  Bottom 0.16: v27.1,26.6 37.8,37.3 v42.5,37.3
VREF
  Top 0.16: U2.6 28.15,27.35 28.05,27.35 | 28.05,27.35 R11.2 | U2.7 28.05,27.35

### Text on the board
tPlace: Umbilical V1.0.3